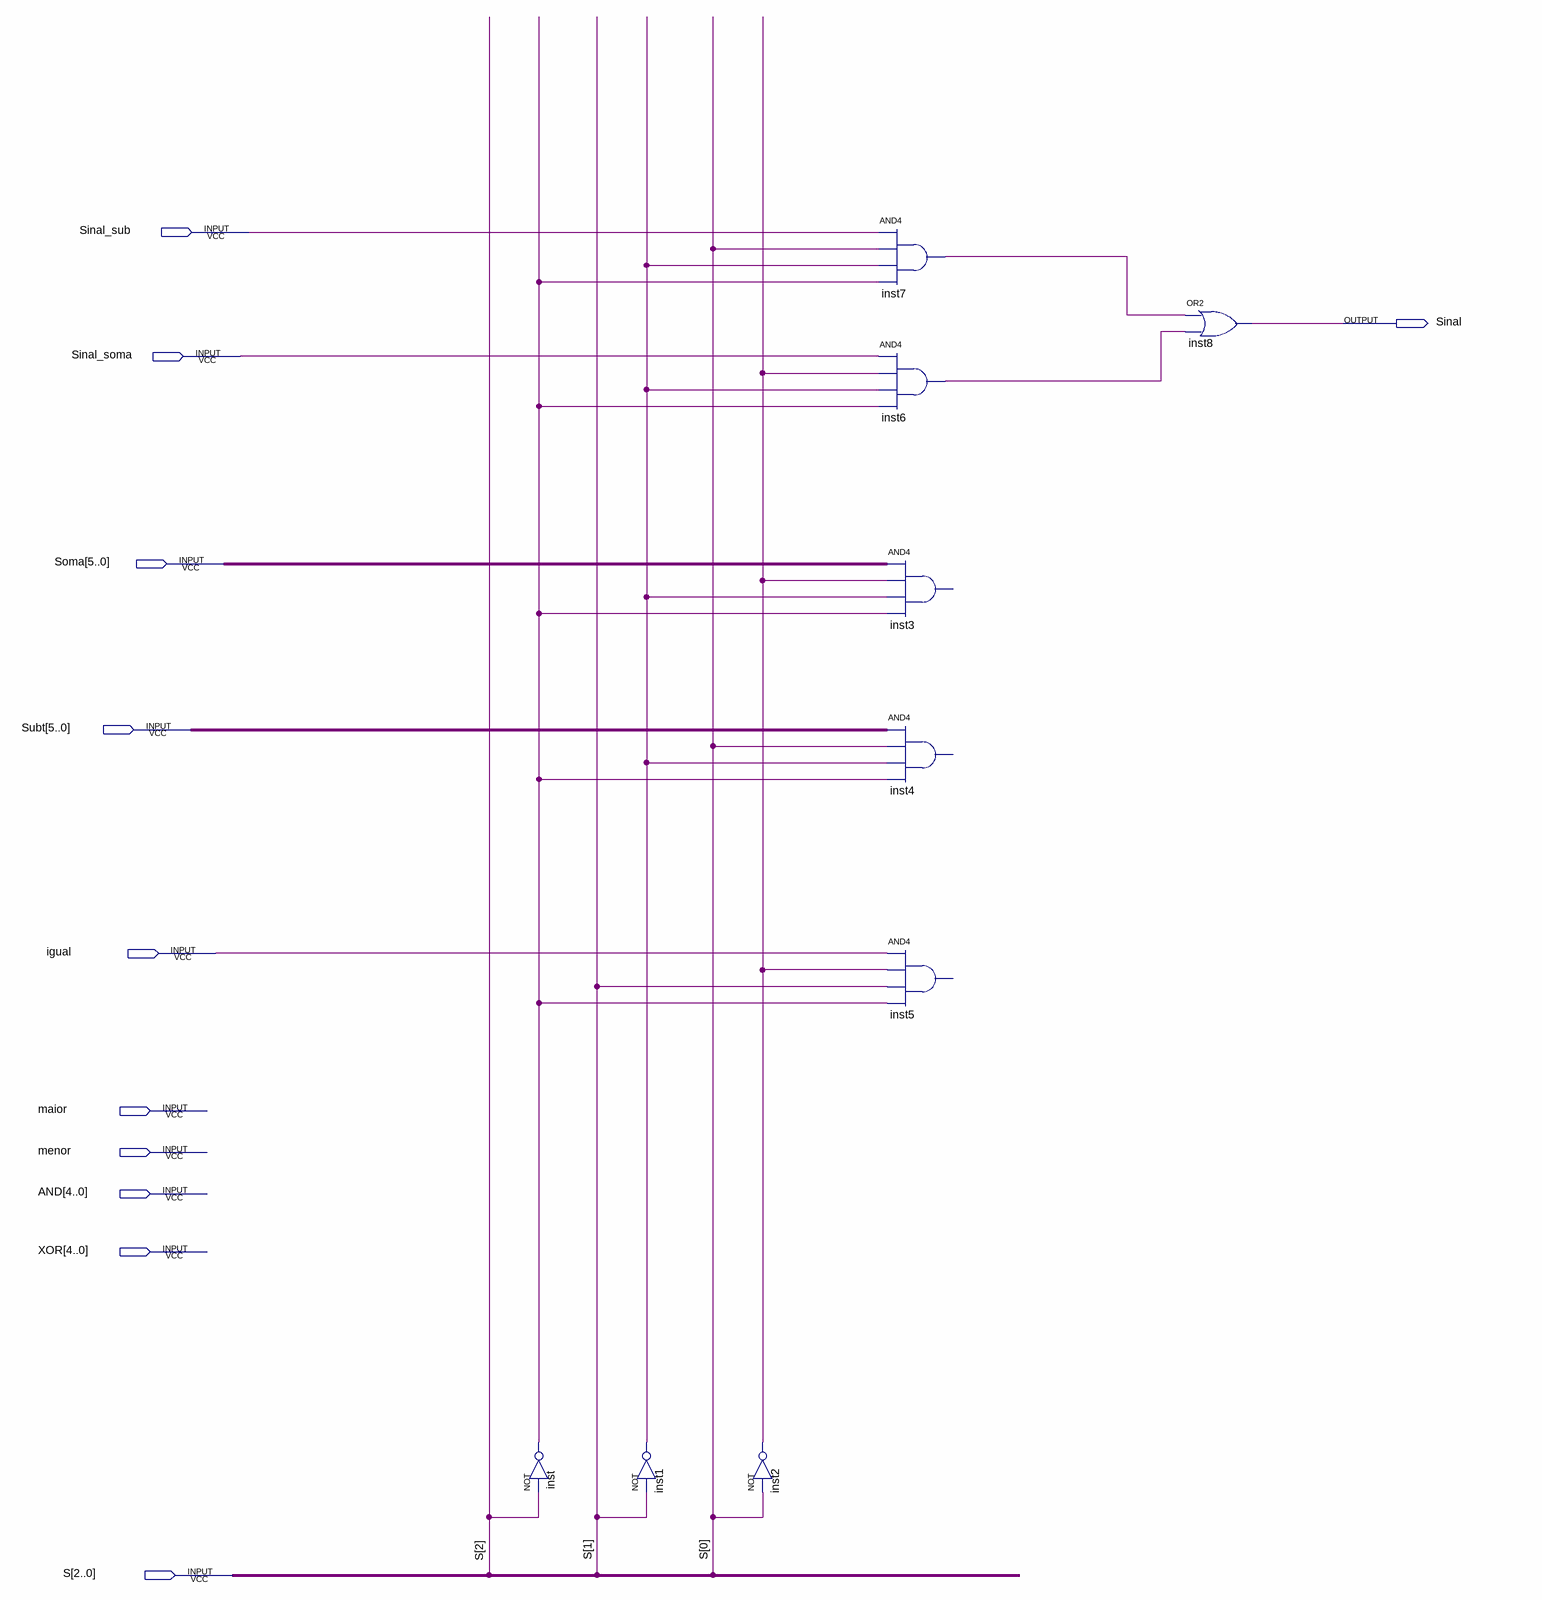
[diagram p0: schematic sheet]
// Quartus schematic mux 8x1.bdf as structural Verilog: 9 symbols, 11 pins
module \mux_8x1  (
  input  Sinal_sub,
  input  Sinal_soma,
  input  [5:0] Soma,
  input  [5:0] Subt,
  input  igual,
  input  maior,
  input  menor,
  input  [4:0] AND,
  input  [4:0] XOR,
  input  [2:0] S,
  output Sinal
);

  wire inst1_out, inst2_out, inst6_out, inst7_out, inst_out;

  not inst (inst_out, S[2]);
  not inst1 (inst1_out, S[1]);
  not inst2 (inst2_out, S[0]);
  and inst7 (inst7_out, Sinal_sub, S[0], inst1_out, inst_out);
  and inst6 (inst6_out, Sinal_soma, inst2_out, inst1_out, inst_out);
  // AND4 inst3 has open pins: IN1=Soma, IN2=inst2_out, IN3=inst1_out, IN4=inst_out, OUT=open
  // AND4 inst4 has open pins: IN1=Subt, IN2=S[0], IN3=inst1_out, IN4=inst_out, OUT=open
  // AND4 inst5 has open pins: IN1=igual, IN2=inst2_out, IN3=S[1], IN4=inst_out, OUT=open
  or inst8 (Sinal, inst7_out, inst6_out);
endmodule
